# EAGLE schematic OLM-REV-5-SMT (EAGLE 6.4)
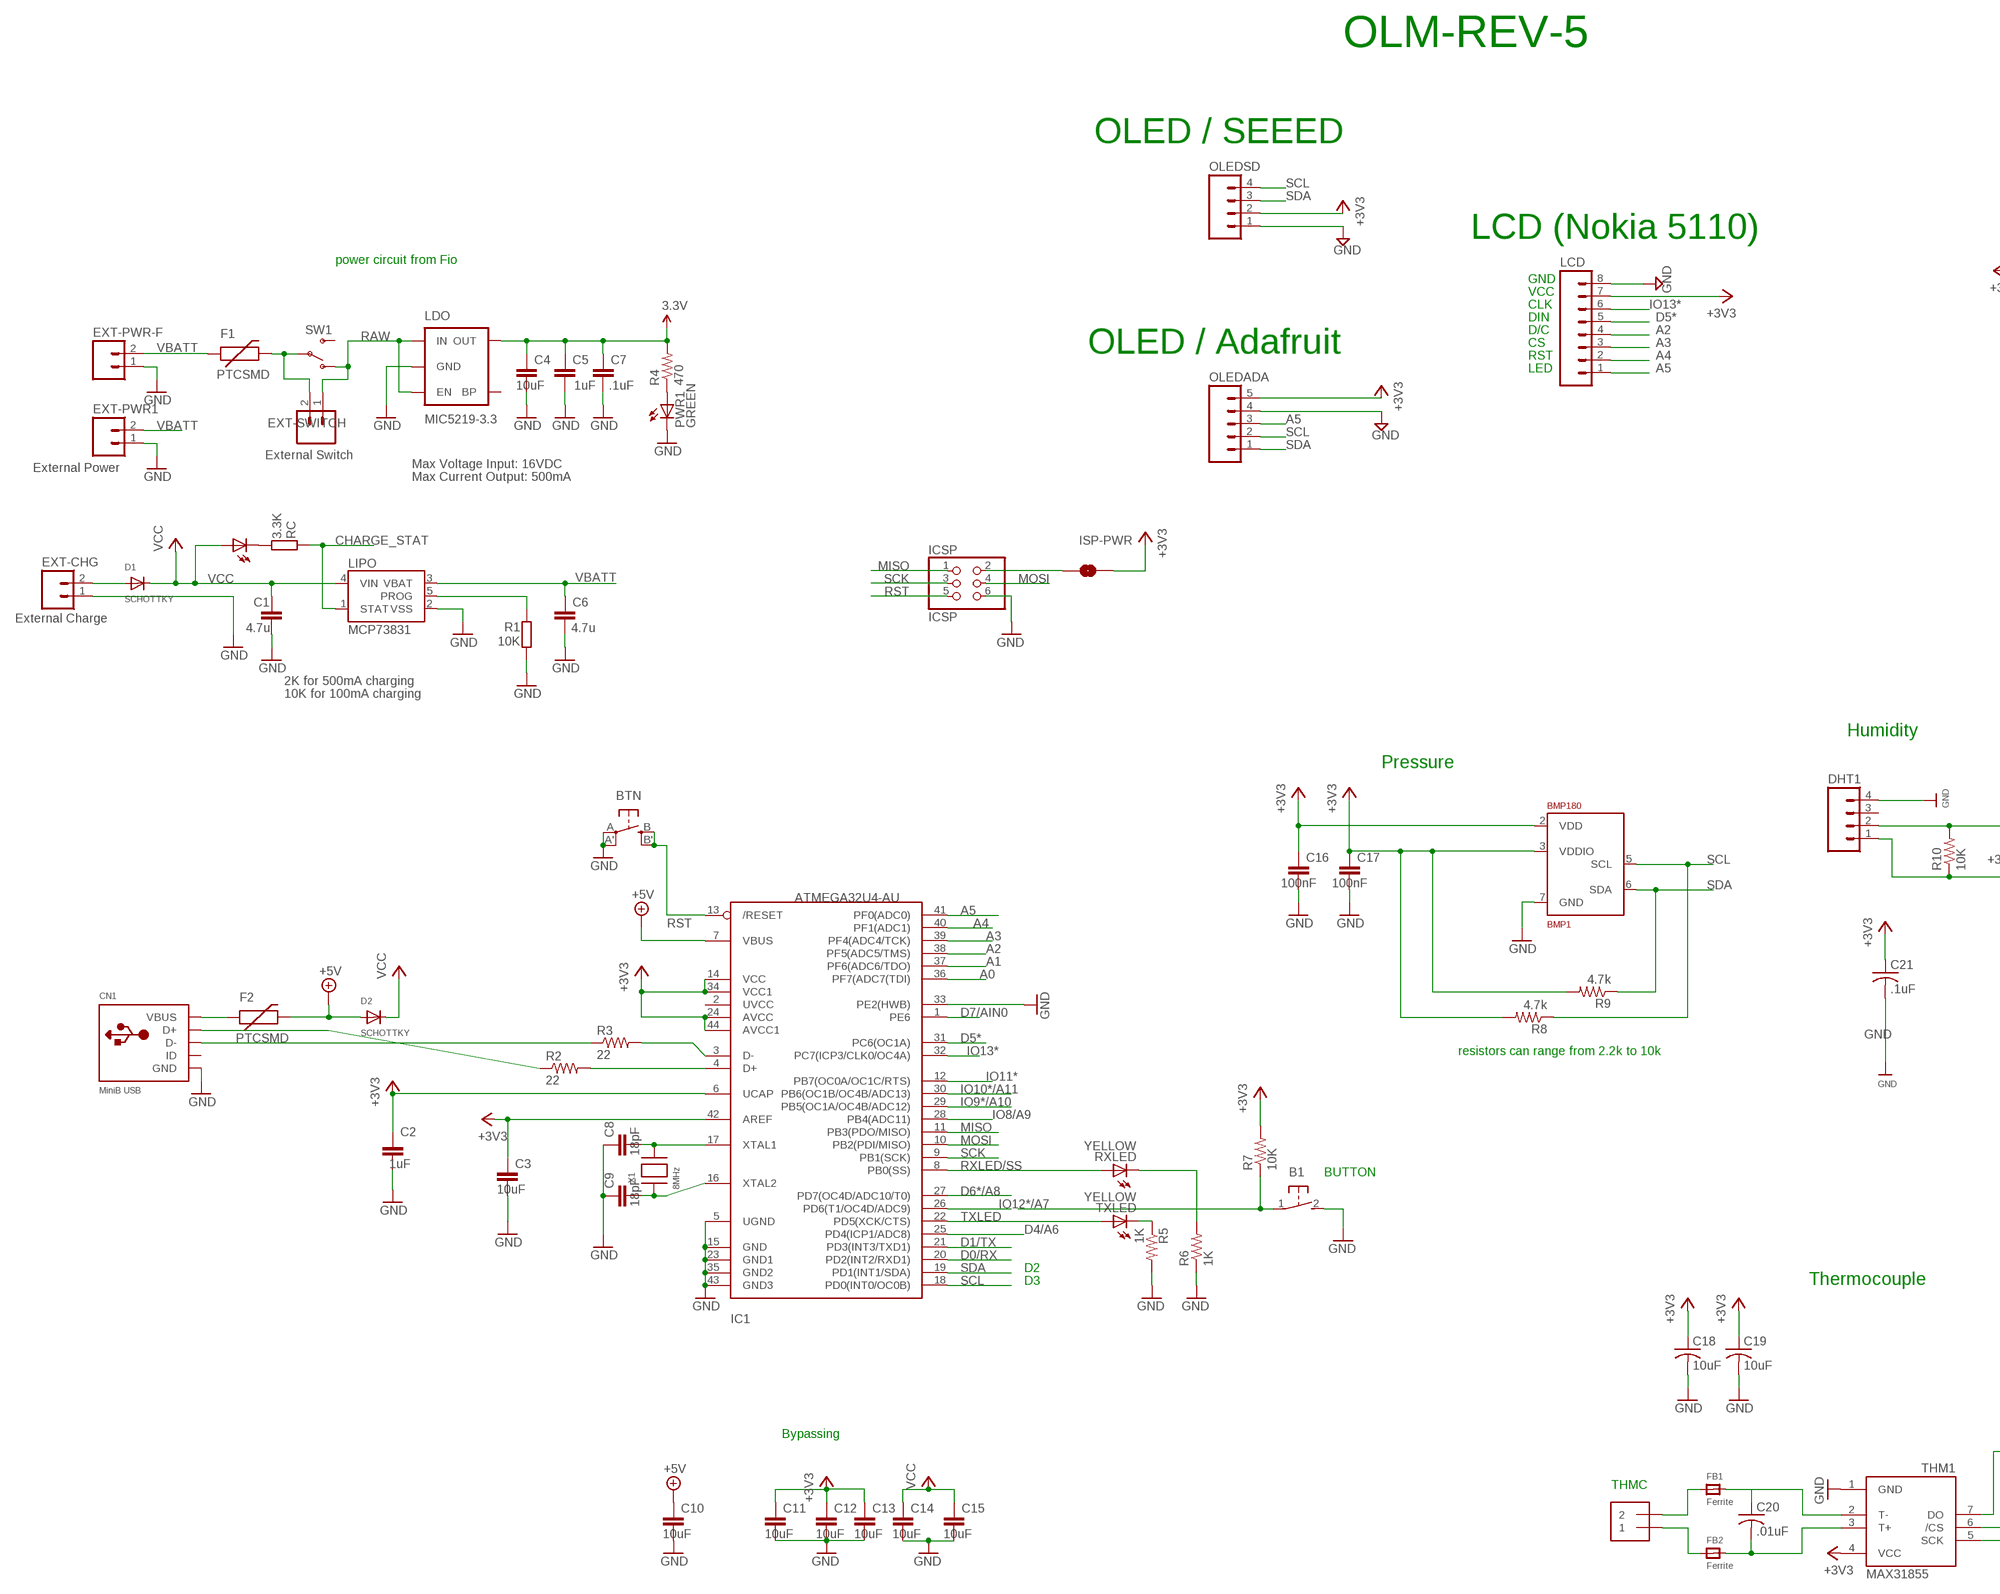
[diagram p0: schematic, sheet 1, part 1 of 2]
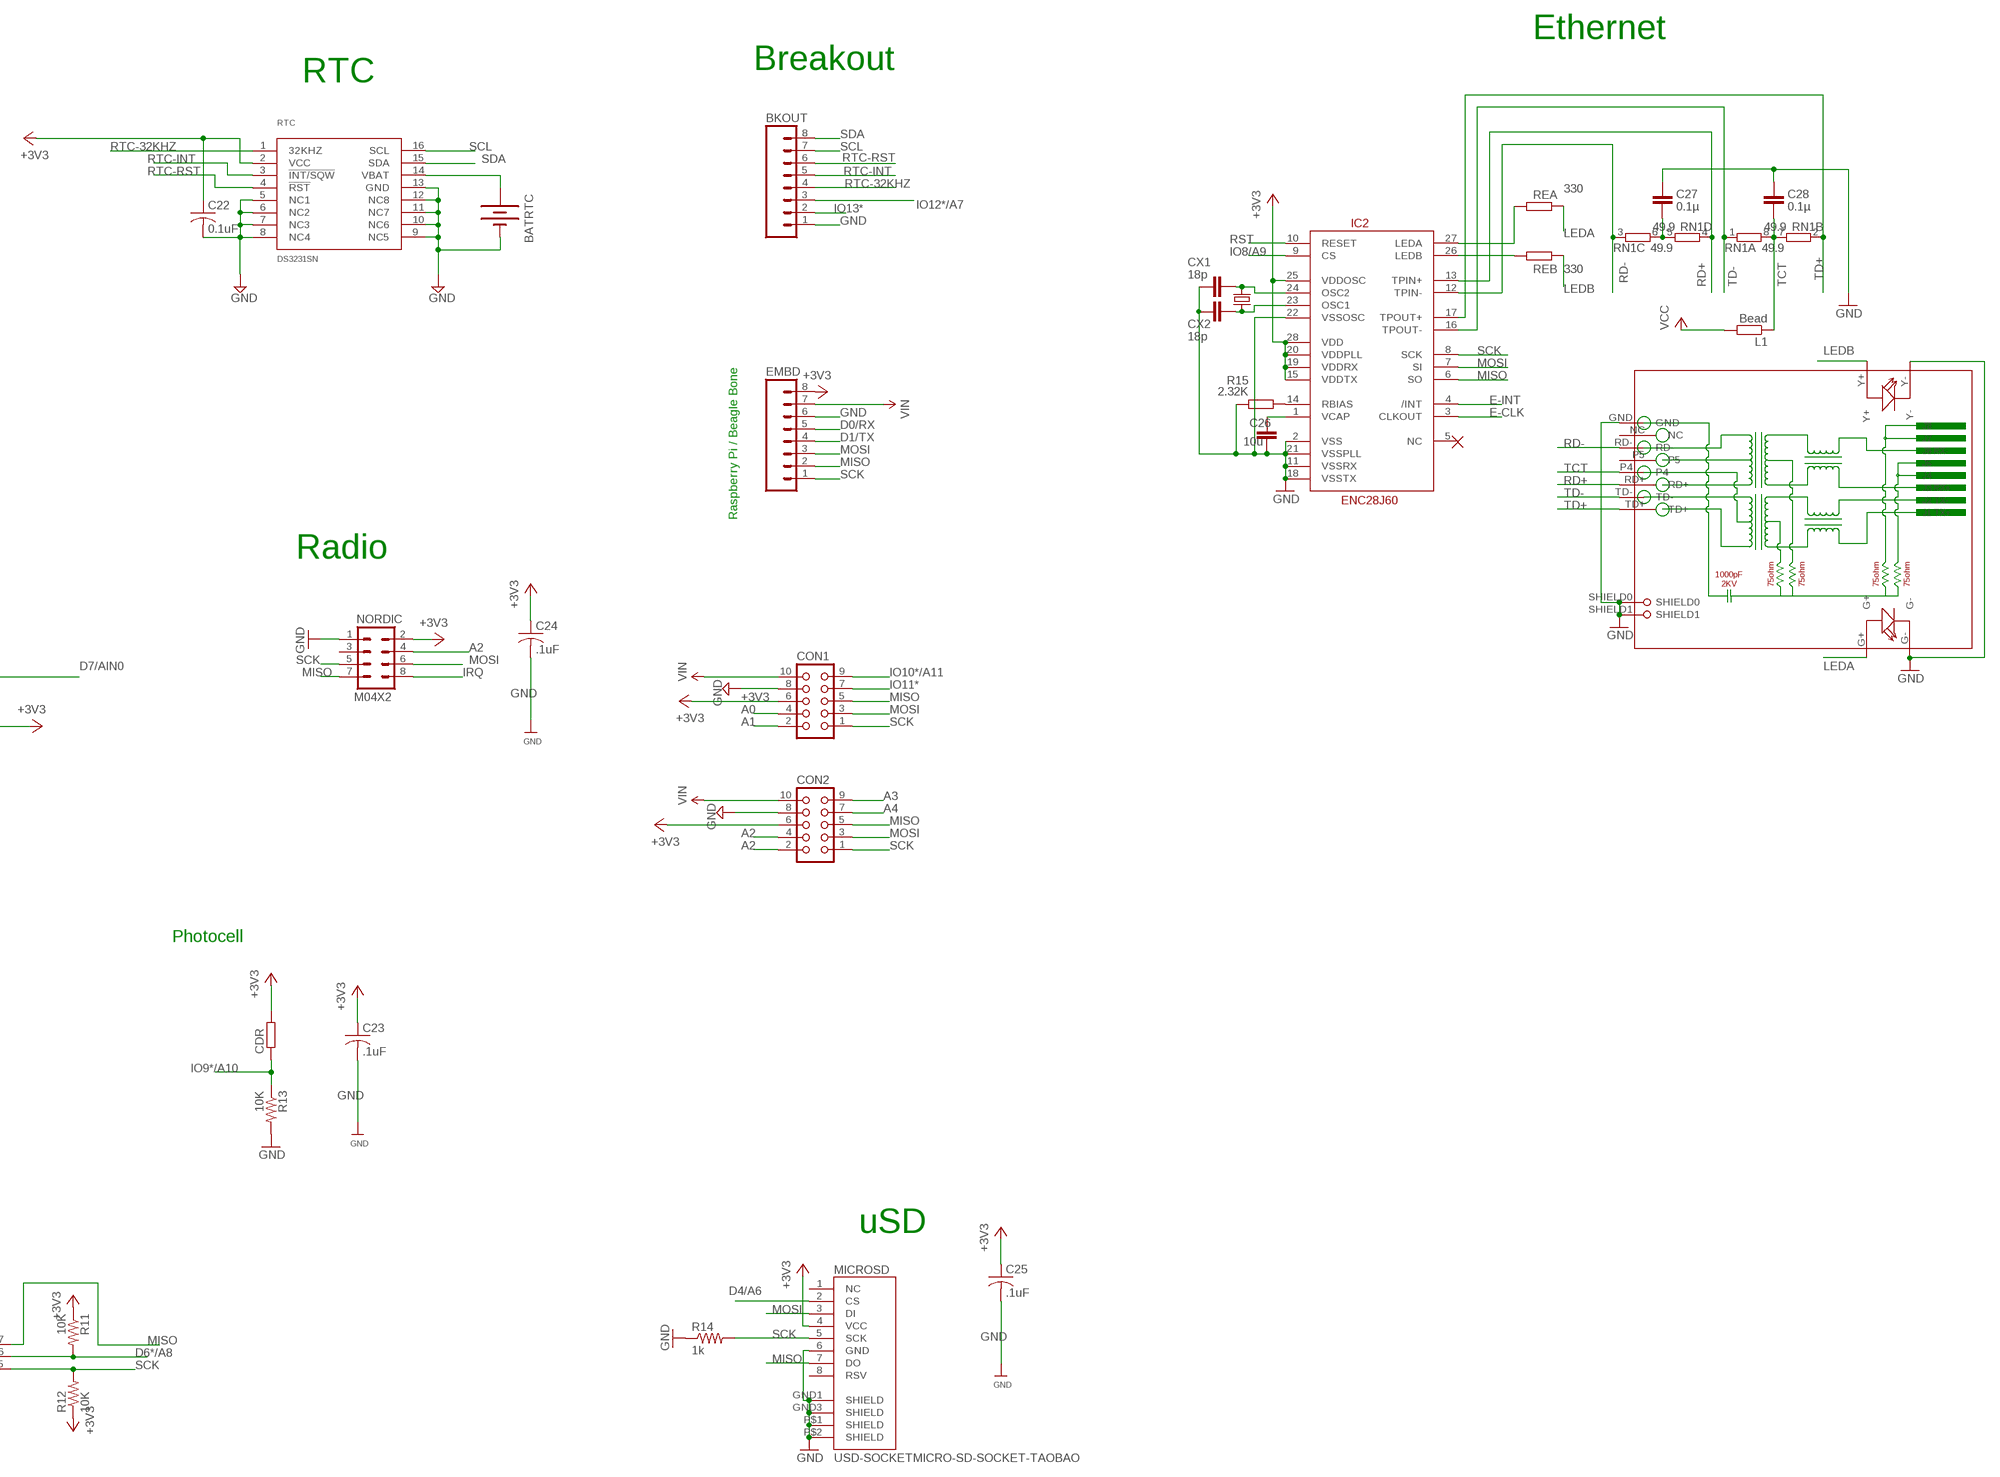
[diagram p1: schematic, sheet 1, part 2 of 2]

## Parts
B1  31-XX  [B3F-31XX]
BATRTC  BATTERYBATTERY_12MM_SMT  [BATTCON_12MM_SMT]
BKOUT  M08LOCK  [1X08_LOCK]
BMP1  BMP180  [LGA7]
BTN  EVQQ2  [EVQ-Q2]
C1  4.7u  C-EUC0805  [C0805]
C2  1uF  C-EUC0805  [C0805]
C3  10uF  C-EUC0805  [C0805]
C4  10uF  C-EUC0805  [C0805]
C5  1uF  C-EUC0805  [C0805]
C6  4.7u  C-EUC0805  [C0805]
C7  .1uF  C-EUC0805  [C0805]
C8  18pF  C-EUC0805  [C0805]
C9  18pF  C-EUC0805  [C0805]
C10  10uF  C-EUC0805  [C0805]
C11  10uF  C-EUC0805  [C0805]
C12  10uF  C-EUC0805  [C0805]
C13  10uF  C-EUC0805  [C0805]
C14  10uF  C-EUC0805  [C0805]
C15  10uF  C-EUC0805  [C0805]
C16  100nF  C-EUC0805  [C0805]
C17  100nF  C-EUC0805  [C0805]
C18  10uF  C-USC0805  [C0805]
C19  10uF  C-USC0805  [C0805]
C20  .01uF  C-USC0805  [C0805]
C21  .1uF  C-USC0805  [C0805]
C22  0.1uF  C-USC0805  [C0805]
C23  .1uF  C-USC0805  [C0805]
C24  .1uF  C-USC0805  [C0805]
C25  .1uF  C-USC0805  [C0805]
C26  10u  C-EUC0805  [C0805]
C27  0.1µ  C-EUC0805  [C0805]
C28  0.1µ  C-EUC0805  [C0805]
CDR  R-EU_0204/7  [0204/7]
CHG1  0805  LEDCHIPLED_0805  [CHIPLED_0805]
CN1  MiniB USB  USBMINIBLARGE  [USB-MINIB_LARGER]
CON1  CON10L  [CON10L]
CON2  CON10L  [CON10L]
CX1  18p  C-EUC0805  [C0805]
CX2  18p  C-EUC0805  [C0805]
D1  SCHOTTKY  DIODESOD-123  [SOD-123]
D2  SCHOTTKY  DIODESOD-123  [SOD-123]
DHT1  M04LOCK  [1X04_LOCK]
EMBD  M08LOCK  [1X08_LOCK]
EXT-CHG  External Charge  M02PTH  [1X02]
EXT-PWR1  External Power  M02PTH  [1X02]
EXT-PWR-F  M02-JST-2MM-SMT  [JST-2-SMD]
EXT-SWITCH  External Switch  M02PTH  [1X02]
EXTL  25MHz  CRYSTAL10.5X4.8  [CRYSTAL-SMD-10.5X4.8-2PIN]
F1  PTCSMD  [PTC-1206]
F2  PTCSMD  [PTC-1206]
FB1  Ferrite  FERRITE_0805  [_0805]
FB2  Ferrite  FERRITE_0805  [_0805]
IC1  ATMEGA32U4-AU  [TQFP44]
IC2  ENC28J60  ENC28J60SO28LONG  [SOIC28WLONG]
ICSP  ICSP  PINHD-2X3  [2X03]
ISP-PWR  SOLDERJUMPERTRACE  [SJ_2S-TRACE]
L1  Bead  R-EU_R0805  [R0805]
LCD  M08LOCK  [1X08_LOCK]
LDO  MIC5219-3.3  V_REG_LDOSMD  [SOT23-5]
LIPO  MCP73831  [SOT23-5]
MICROSD  USD-SOCKETMICRO-SD-SOCKET-TAOBAO  [MICRO-SD-SOCKET-TAOBAO]
NORDIC  M04X2  [2X4]
OLEDADA  M05LOCK  [1X05_LOCK]
OLEDSD  M04LOCK  [1X04_LOCK]
PWR1  GREEN  LEDCHIPLED_0805  [CHIPLED_0805]
R1  10K  R-EU_R0805  [R0805]
R2  22  R-US_R0805  [R0805]
R3  22  R-US_R0805  [R0805]
R4  470  R-US_R0805  [R0805]
R5  1K  R-US_R0805  [R0805]
R6  1K  R-US_R0805  [R0805]
R7  10K  R-US_R0805  [R0805]
R8  4.7k  R-US_R0805  [R0805]
R9  4.7k  R-US_R0805  [R0805]
R10  10K  R-US_R0805  [R0805]
R11  10K  R-US_R0805  [R0805]
R12  10K  R-US_R0805  [R0805]
R13  10K  R-US_R0805  [R0805]
R14  1k  R-US_R0805  [R0805]
R15  2.32K  R-EU_R0805  [R0805]
RC  3.3K  R-EU_R0805  [R0805]
REA  330  R-EU_R0805  [R0805]
REB  330  R-EU_R0805  [R0805]
RJ1  HR911105A  [HR911105A]
RN1  49.9  4R-NEXB38V  [EXB38V]
RTC  DS3231SN  [SO16W]
RXLED  YELLOW  LEDCHIPLED_0805  [CHIPLED_0805]
SW1  SPDT  SWITCH-SPSTSMD2  [SWITCH-SPDT-SMD]
THM1  MAX31855  MAX6675  [SO08]
THMC  1X2-3.5MM  [1X2-3.5MM]
TXLED  YELLOW  LEDCHIPLED_0805  [CHIPLED_0805]
X1  8MHz  XTALNX5032  [NX5032]

## Nets
3.3V [vcc]: C4.1 C5.1 C7.1 LDO.5(OUT) R4.2
+3V3: BMP1.2(VDD) BMP1.3(VDDIO) C2.1 C3.1 C11.1 C12.1 C13.1 C16.1 C17.1 C18.1 C19.1 C21.1 C22.1 C23.1 C24.1 C25.1 CDR.2 CON1.6 CON2.6 DHT1.1 EMBD.8 IC1.6(UCAP) IC1.14(VCC) IC1.24(AVCC) IC1.34(VCC1) IC1.42(AREF) IC1.44(AVCC1) IC2.15(VDDTX) IC2.19(VDDRX) IC2.20(VDDPLL) IC2.25(VDDOSC) IC2.28(VDD) ISP-PWR.2 LCD.7 MICROSD.4(VCC) NORDIC.2 OLEDADA.5 OLEDSD.2 R7.2 R8.2 R9.2 R10.1 R11.1 R12.1 RTC.2(VCC) THM1.4(VCC)
+5V: C10.1 D2.A F2.2 IC1.7(VBUS)
A0: CON1.4
A1: CON1.2
A2: CON2.2 CON2.4 LCD.4 NORDIC.4
A3: CON2.9 LCD.3
A4: CON2.7 LCD.2
A5: LCD.1 OLEDADA.3
CHARGE_STAT: LIPO.1(STAT) RC.2
D0/RX: EMBD.5
D1/TX: EMBD.4
D4/A6: MICROSD.2(CS)
D5*: LCD.5
D6*/A8: R11.2 THM1.6(/CS)
D7/AIN0: DHT1.2 R10.2
E-CLK: IC2.3(CLKOUT)
E-INT: IC2.4(/INT)
GND: B1.2(S) BATRTC.P$1(-) BKOUT.1 BMP1.7(GND) BTN.A'(P1) BTN.A(P) C1.2 C2.2 C3.2 C4.2 C5.2 C6.2 C7.2 C8.1 C9.1 C10.2 C11.2 C12.2 C13.2 C14.2 C15.2 C16.2 C17.2 C18.2 C19.2 C21.2 C22.2 C23.2 C24.2 C25.2 C26.2 C27.1 C28.1 CN1.GND CON1.8 CON2.8 CX1.2 CX2.2 DHT1.4 EMBD.6 EXT-CHG.1 EXT-PWR1.1 EXT-PWR-F.1 IC1.5(UGND) IC1.15(GND) IC1.23(GND1) IC1.35(GND2) IC1.43(GND3) IC2.2(VSS) IC2.11(VSSRX) IC2.18(VSSTX) IC2.21(VSSPLL) IC2.22(VSSOSC) ICSP.6 LCD.8 LDO.2(GND) LIPO.2(VSS) MICROSD.6(GND) MICROSD.GND1(SHIELD) MICROSD.GND3(SHIELD) MICROSD.P$1(SHIELD) MICROSD.P$2(SHIELD) NORDIC.1 OLEDADA.4 OLEDSD.1 PWR1.C R1.1 R5.2 R6.1 R13.2 R14.1 R15.1 RJ1.G- RJ1.GND RJ1.SHIELD0 RJ1.SHIELD1 RJ1.Y- RTC.5(NC1) RTC.6(NC2) RTC.7(NC3) RTC.8(NC4) RTC.9(NC5) RTC.10(NC6) RTC.11(NC7) RTC.12(NC8) RTC.13(GND) THM1.1(GND)
IO8/A9: IC2.9(CS)
IO9*/A10: CDR.1 R13.1
IO10*/A11: CON1.9
IO11*: CON1.7
IO13*: BKOUT.2 LCD.6
IRQ: NORDIC.8
LEDA: REA.2 RJ1.G+
LEDB: REB.2 RJ1.Y+
MISO: CON1.5 CON2.5 EMBD.2 IC2.6(SO) ICSP.1 MICROSD.7(DO) NORDIC.7 THM1.7(DO)
MOSI: CON1.3 CON2.3 EMBD.3 IC2.7(SI) ICSP.4 MICROSD.3(DI) NORDIC.6
N$1: BKOUT.3
N$2: CN1.D+ R2.1
N$3: IC1.3(D-) R3.2
N$4: IC1.4(D+) R2.2
N$5: CN1.D- R3.1
N$6: B1.1(P) R7.1
N$8: C8.2 IC1.17(XTAL1) X1.P$2
N$9: C9.2 IC1.16(XTAL2) X1.P$1
N$10: PWR1.A R4.1
N$11: R5.1 TXLED.C
N$12: R6.2 RXLED.C
N$14: EXT-SWITCH.2 F1.2 SW1.2(P)
N$15: C27.2 RN1.5 RN1.6
N$16: IC2.26(LEDB) REB.1
N$17: C26.1 IC2.1(VCAP)
N$18: IC2.14(RBIAS) R15.2
N$19: CX1.1 EXTL.P$2 IC2.24(OSC2)
N$20: CX2.1 EXTL.P$1 IC2.23(OSC1)
N$21: IC2.27(LEDA) REA.1
N$22: BATRTC.P$2(+) RTC.14(VBAT)
N$23: FB1.1 THMC.2
N$24: C20.1 FB1.2 THM1.2(T-)
N$25: FB2.1 THMC.1
N$26: C20.2 FB2.2 THM1.3(T+)
N$30: CHG1.C RC.1
N$31: LIPO.5(PROG) R1.2
N$33: D1.A EXT-CHG.2
RAW [vcc]: EXT-SWITCH.1 LDO.1(IN) LDO.3(EN) SW1.1(O)
RAW1 [vcc]: ISP-PWR.1
RD+: IC2.13(TPIN+) RJ1.RD+ RN1.4
RD-: IC2.12(TPIN-) RJ1.RD- RN1.3
RST: BTN.B'(S1) BTN.B(S) IC1.13(/RESET) IC2.10(RESET) ICSP.5
RTC-32KHZ: BKOUT.4 RTC.1(32KHZ)
RTC-INT: BKOUT.5 RTC.3(!INT/SQW)
RTC-RST: BKOUT.6 RTC.4(!RST)
RXLED/SS: RXLED.A
SCK: CON1.1 CON2.1 EMBD.1 IC2.8(SCK) ICSP.3 MICROSD.5(SCK) NORDIC.5 R12.2 THM1.5(SCK)
SCK1: R14.2
SCL: BKOUT.7 BMP1.5(SCL) OLEDADA.2 OLEDSD.4 R8.1 RTC.16(SCL)
SDA: BKOUT.8 BMP1.6(SDA) OLEDADA.1 OLEDSD.3 R9.1 RTC.15(SDA)
TCT: C28.2 L1.1 RJ1.P4 RN1.7 RN1.8
TD+: IC2.17(TPOUT+) RJ1.TD+ RN1.2
TD-: IC2.16(TPOUT-) RJ1.TD- RN1.1
TXLED: TXLED.A
VBATT: C6.1 EXT-PWR1.2 EXT-PWR-F.2 F1.1 LIPO.3(VBAT)
VBUS: CN1.VBUS F2.1
VCC: C1.1 C14.1 C15.1 CHG1.A D1.C D2.C L1.2 LIPO.4(VIN)
VIN: CON1.10 CON2.10 EMBD.7
Unconnected: BMP1.1 BMP1.4 CN1.ID DHT1.3 IC1.1(PE6) IC1.2(UVCC) IC1.8(PB0(SS)) IC1.9(PB1(SCK)) IC1.10(PB2(PDI/MISO)) IC1.11(PB3(PDO/MISO)) IC1.12(PB7(OC0A/OC1C/RTS)) IC1.18(PD0(INT0/OC0B)) IC1.19(PD1(INT1/SDA)) IC1.20(PD2(INT2/RXD1)) IC1.21(PD3(INT3/TXD1)) IC1.22(PD5(XCK/CTS)) IC1.25(PD4(ICP1/ADC8)) IC1.26(PD6(T1/OC4D/ADC9)) IC1.27(PD7(OC4D/ADC10/T0)) IC1.28(PB4(ADC11)) IC1.29(PB5(OC1A/OC4B/ADC12)) IC1.30(PB6(OC1B/OC4B/ADC13)) IC1.31(PC6(OC1A)) IC1.32(PC7(ICP3/CLK0/OC4A)) IC1.33(PE2(HWB)) IC1.36(PF7(ADC7(TDI)) IC1.37(PF6(ADC6/TDO)) IC1.38(PF5(ADC5/TMS)) IC1.39(PF4(ADC4/TCK)) IC1.40(PF1(ADC1)) IC1.41(PF0(ADC0)) IC2.5(NC) ICSP.2 LDO.4(BP) MICROSD.1(NC) MICROSD.8(RSV) NORDIC.3 RJ1.NC RJ1.P5 SW1.3(S)

## Notes on the sheet
- OLM-REV-5
- OLED / SEEED
- Ethernet
- Breakout
- RTC
- LCD (Nokia 5110)
- power circuit from Fio
- GND
- VCC
- CLK
- DIN
- D/C
- CS
- OLED / Adafruit
- RST
- LED
- Max Voltage Input: 16VDC
- Max Current Output: 500mA
- Raspberry Pi / Beagle Bone
- 2K for 500mA charging
- 10K for 100mA charging
- Radio
- Humidity
- Pressure
- resistors can range from 2.2k to 10k
- Photocell
- BUTTON
- D2
- D3 | Thermocouple
- uSD
- Bypassing
- THMC

## Library data of the parts
B1 = adafruit:31-XX: OMRON SWITCH Now with beefier pads!
BATRTC = SparkFunNew:BATTERY: Battery Holders Various common sizes : AA, AAA, 20mm coin cell and 12mm coin cell.
BKOUT EMBD LCD = SparkFun-Connectors:M08: Header 8 Standard 8-pin 0.1" header. Use with straight break away headers (SKU : PRT-00116), right angle break away headers (PRT-00553), swiss pins (PRT-00743), machine pins (PRT-00117), and female headers (PRT-00115).
BMP1 = DSSCircuits:BMP180; I2C: I2C
BTN = adafruit:EVQQ2: SMT 6mm switch, EVQQ2 series http://www.ladyada.net/library/eagle
C1-C17 C26-C28 CX1 CX2 = resistor:C-EU: CAPACITOR, European symbol
C18-C21 C23-C25 = adafruit:C-US: CAPACITOR, American symbol
C22 = rcl:C-US: CAPACITOR, American symbol
CDR = resistor:R-EU_: RESISTOR, European symbol
CHG1 = led:LED: LED
CN1 = microbuilder:USB: USB Connectors USBMINIB - Surface Mount Female Mini-B USB Connector 4UConnector: 06564
CON1 CON2 = con-harting:CON10L: CONNECTOR; OC_FARNELL: unknown; OC_NEWARK: unknown
D1 D2 = adafruit:DIODE: Diode SMADIODE - SMA Surface Mount Package 20V 1A Schottky Diode Digikey: 641-1014-6-ND DO-1N4148 - Through Hole Small Current Diode SOD-123 20V 1 A (.5mV Vf) Schottky Diode - Digikey: MBRX120TPMSCT-ND SOD-323 10V 570mA (.38mV Vf, 3ns) Schottky Diode - Digikey: ZLLS410CT-ND SOD-523 30V 30mA Schottky Diode (RB751S-40TE61) - Digikey: RB751S-40TE61CT-ND SOT23-R/W - SOT23 Package (R = Solder Paste/Reflow Ovens, W = Hand-Soldering) BAT54Film 40V 300mA - Digikey: 497-7162-1-ND
DHT1 OLEDSD = SparkFun-Connectors:M04: Header 4 Standard 4-pin 0.1" header. Use with straight break away headers (SKU : PRT-00116), right angle break away headers (PRT-00553), swiss pins (PRT-00743), machine pins (PRT-00117), and female headers (PRT-00115). Molex polarized connector foot print use with SKU : PRT-08231 with associated crimp pins and housings. 1MM SMD Version SKU: PRT-10208
EXT-CHG EXT-PWR1 EXT-PWR-F EXT-SWITCH = SparkFun:M02: Header 2 Standard 2-pin 0.1" header. Use with straight break away headers (SKU : PRT-00116), right angle break away headers (PRT-00553), swiss pins (PRT-00743), machine pins (PRT-00117), and female headers (PRT-00115). Molex polarized connector foot print use with SKU : PRT-08233 with associated crimp pins and housings.
EXTL = SparkFun:CRYSTAL: Crystals Various standard crystals. Proven footprints. Spark Fun Electronics SKU : COM-00534
F1 F2 = SparkFun:PTC: Resettable Fuse PTC Resettable Fuse. Spark Fun Electronics SKU : COM-08357
FB1 FB2 = microbuilder:FERRITE: Ferrite Bead 0603 MMZ1608B121C - 120 Ohm @ 100MHz, 600mA, 0.15 Ohm DC Resistance - Digikey: 445-2164-1-ND BK1608HW121-T - 120 Ohm, 600mA Ferrite Chip - Digikey: 587-1876-2-ND 0805 HZ0805B272R-10 - 2.7K Ohm @ 100MHz, 200mA, 0.8 Ohm DC Resistance - Digikey: 240-2504-1-ND (see also Murata BLM21BD272SN1L) MMZ2012Y152B - 1.5K Ohm @ 100MHz, 500mA, 0.4 Ohm DC Resistance - Digikey: 445-1560-1-ND - Mainly for high frequency (80-400MHz) MMZ2012R102A - 1K Ohm @ 100MHz, 500mA, 0.3 Ohm DC Resistance - Digikey: 445-1555-2-ND - More general purpose (10-200MHz)
IC1 = adaprog:ATMEGA32U4
IC2 = SparkFun:ENC28J60
ICSP = pinhead:PINHD-2X3: PIN HEADER
ISP-PWR = SparkFun:SOLDERJUMPER: Solder Jumper Standard SMD solder jumper. Used to automate production. Two varients : Normally Open and Normally Closed are the same, but have different paste layers. NC will have a large amount of paste and should jumper during reflow.
L1 R1 R15 RC REA REB = rcl:R-EU_: RESISTOR, European symbol
LDO = SparkFun:V_REG_LDO: Voltage Regulator LDO Standard 150mA LDO voltage regulator in SOT-23 layout. Micrel part MIC5205. BP (by-pass) pin is used to lower output noise with 470pF cap.
LIPO = SparkFun:MCP73831: Microchip's MCP73831 Miniature single cell, fully integrated Li-Ion, Li-polymer charge management controller http://ww1.microchip.com/downloads/en/DeviceDoc/21984a.pdf
MICROSD = SparkFunNew:USD-SOCKET: microSD Socket Push-push type uSD socket. Schematic element and footprint production proven. Spark Fun Electronics SKU : PRT-00127. tDoc lines correctly indicate media card edge positions when inserting (unlocked, locked, depressed).
NORDIC = SparkFun-Connectors:M04X2: .1" header, two rows of four.
OLEDADA = SparkFun-Connectors:M05: Header 5 Standard 5-pin 0.1" header. Use with straight break away headers (SKU : PRT-00116), right angle break away headers (PRT-00553), swiss pins (PRT-00743), machine pins (PRT-00117), and female headers (PRT-00115). Molex polarized connector foot print use with SKU : PRT-08230 with associated crimp pins and housings.
PWR1 RXLED TXLED = adafruit:LED: LED
R2-R14 = adafruit:R-US_: RESISTOR, American symbol
RJ1 = CONNECTER:HR911105A
RN1 = resistor-dil:4R-N: Array Chip Resistor Source: RS Component / Phycomp; OC_FARNELL: unknown; OC_NEWARK: unknown
RTC = comfile:DS3231SN
SW1 = SparkFun:SWITCH-SPST: SPST Switch Simple slide switch. Spark Fun Electronics SKU : COM-00102
THM1 = adafruit:MAX6675
THMC = adafruit:1X2: 3.5mm Terminal block http://www.ladyada.net/library/pcb/eaglelibrary.html
X1 = adaprog:XTAL

## Net classes
0 Default: width 0.203 mm